# Altium schematic sheet RF-PCBF-2G4.SchDoc: =ProjectTitle
size 209 x 297 mm; Address1: Address1; Address2: Address2; Address3: Address3; Address4: Address4; SheetNumber: 8; SheetTotal: 9; Scale: 1:1; DocumentType: Схема электрическая принципиальная
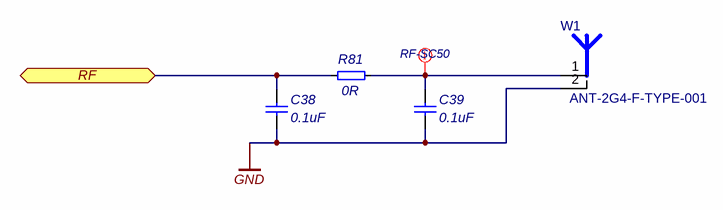
[diagram p0: RF-PCBF-2G4.SchDoc]

## Parts
C38  0.1uF  [C0402]
C39  0.1uF  [C0402]
R81  0R  [R_0402]
W1  ANT-2G4-F-TYPE-001  [ANT-2G4-F-TYPE-001]  (net tie, no BOM)

## Ports
RF (bidir)

## Nets
GND: C38.1 C39.1 W1.2(Fix_pad_2)
RF: C38.2 R81.1 ; port RF
NetC39_2: C39.2 R81.2 W1.1(Out)

Not connected (* = marked no-connect by the designer): W1 3(Fix_pad_3) 4(Fix_pad_4)

## Layout directives
net class RF-SC50: NetC39_2

## Notes on the sheet
- Подп. и дата
- Инв. № дубл.
- Взам. инв. №
- Symbol name: =SheetSymbolDesignator
  File name: =DocumentName
  Variant name (Short): =ProjectVariant ( =ProjectBoardVariant )
  Version on board: =ProjectRevisionCode
- Инв. № подл.
- Изм.
- Лист
- № докум.
- Подп.
- Дата
- 2.106-A4
- Копировал
- Формат А4

## Library data of the parts
C38 C39 = 0402-X5R-50V-0.1uF±10%: Manufacturer: Yageo; NameFromManufacturer: CC0402KRX5R9BB104; Place: S; Voltage: 50V; Tolerance: 10%; Check: False; Part Number: 0402-X5R-50V-0.1uF±10%; Value: 0.1uF; Temperature: -55°C~85°C; ComponentLink2Description: Link to datasheet; ComponentLink1Description: DATASHEET; ComponentLink2URL: https://www.yageo.com/upload/media/product/productsearch/datasheet/mlcc/UPY-GPHC_X5R_4V-to-50V_26.pdf; ComponentLink1URL: Datasheets/capacitors/UPY-GPHC_X5R_4V-to-50V_26.pdf; Last changed: 27.10.2022
R81 = 0402-0.0625W-0R-100ppm±1%: NameFromManufacturer: RC0402FR-070RL; Manufacturer: Yageo; Place: S; Tolerance: 1%; Check: False; Part Number: 0402-0.0625W-0R-100ppm±1%; Value: 0R; Temperature: -55°C~155°C; ComponentLink1Description: DATASHEET; ComponentLink1URL: https://www.chipdip.ru/product0/8000617426?ysclid=l7og5x0plo427794326; Datasheet: Datasheets/resistors/DOC012445956.pdf; Last changed: 27.10.2022
W1 = ANT-2G4-F-TYPE-001: Antenna; Place: S; Check: False; ComponentLink1Description: DATASHEET; ComponentLink1URL: *; Part Number: ANT-2G4-F-TYPE-001; Value: ANT-2G4-F-TYPE-001; NameFromManufacturer: ANT-2G4-F-TYPE-001; Last changed: 27.10.2022